# EAGLE design Venus638FLPX-L (EAGLE 6.3)
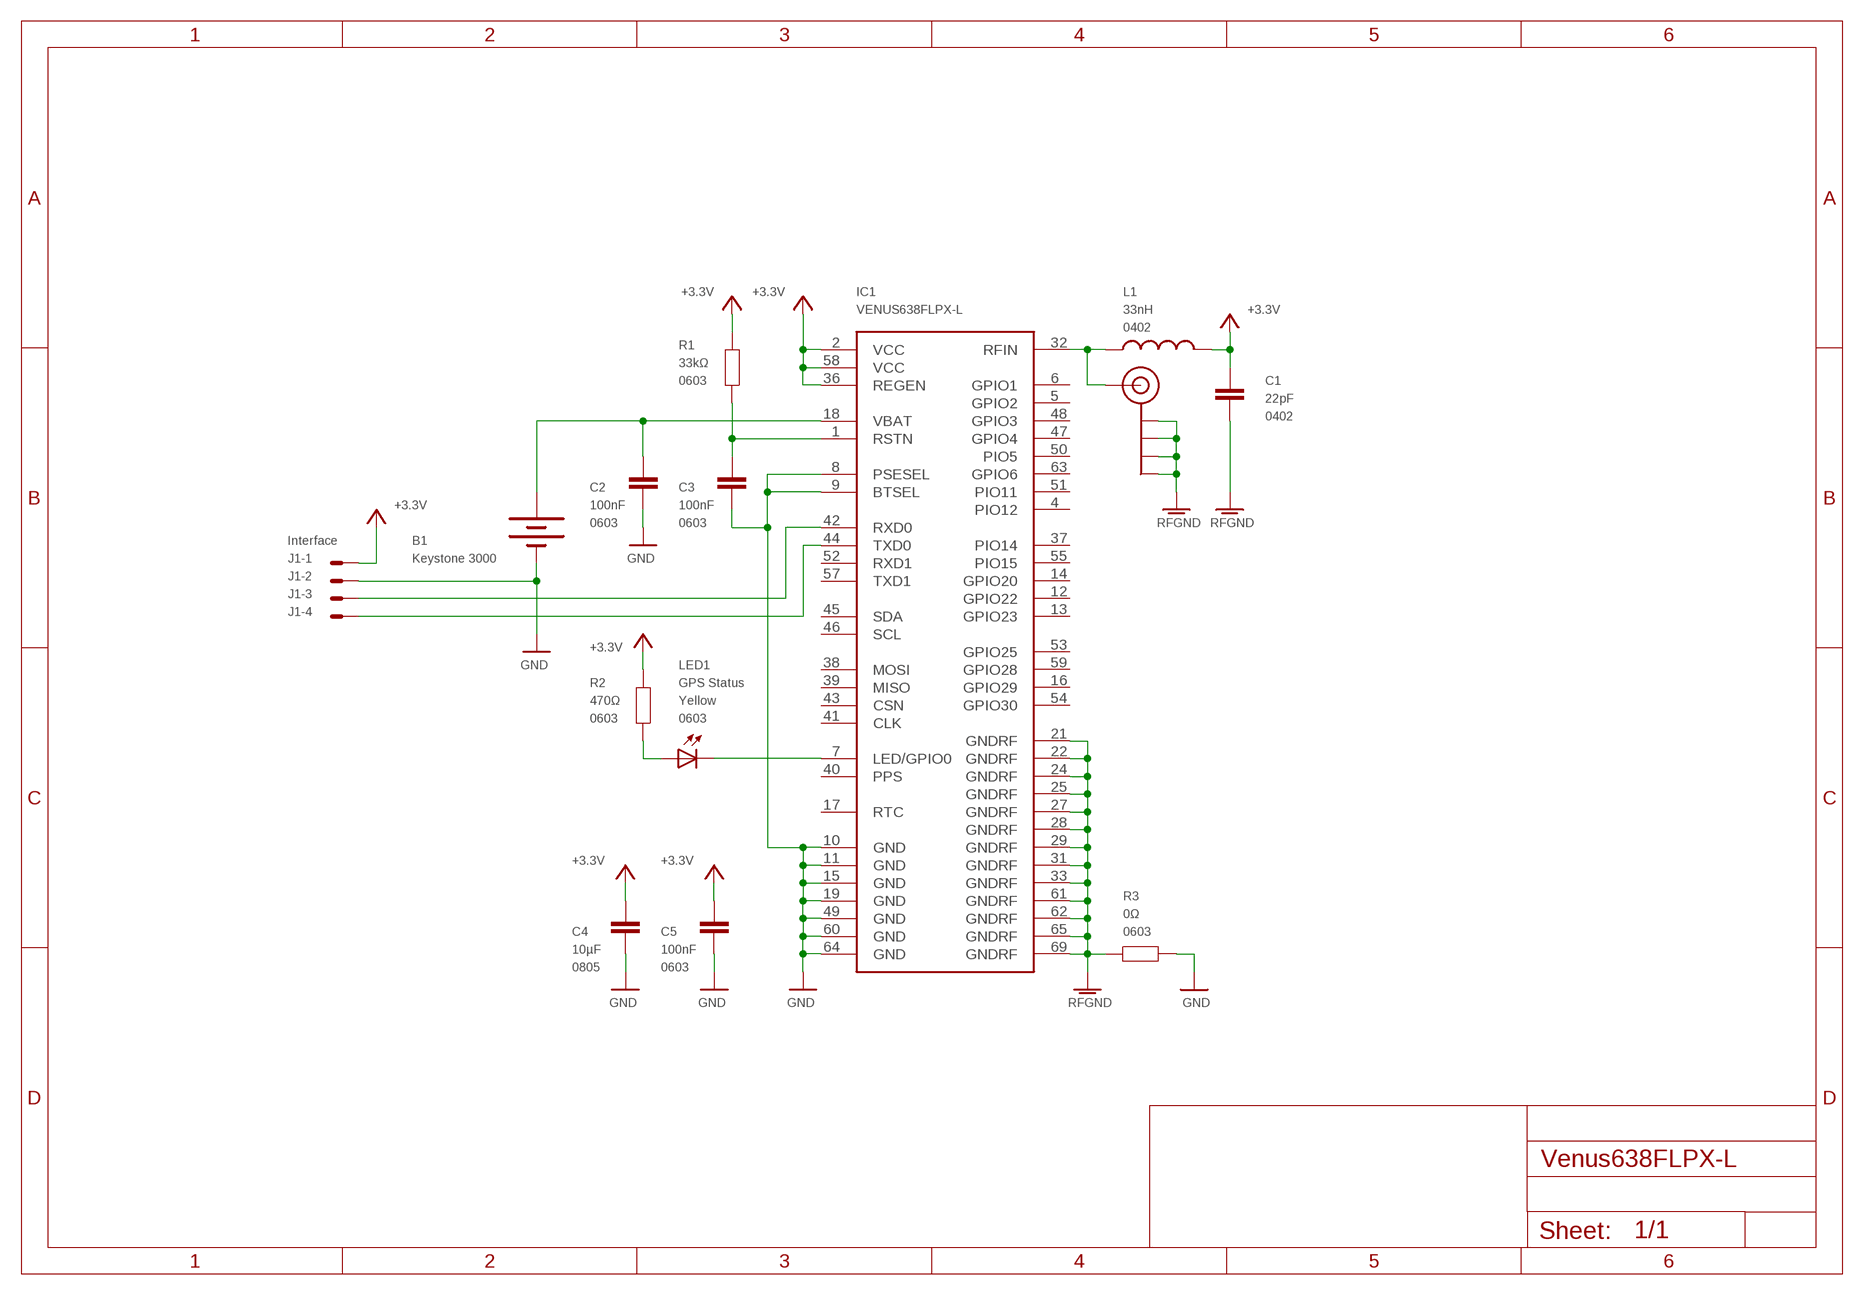
[diagram p0: schematic, sheet 1]

## Parts
B1  Keystone 3000  BATTERY12MM  [BATTCON_12MM]
C1  22pF  CAP0402  [C0402]
C2  100nF  CAP0603  [0603]
C3  100nF  CAP0603  [0603]
C4  10µF  CAP0805  [0805]
C5  100nF  CAP0603  [0603]
IC1  VENUS638FLPX-L  [VENUS638FLPX]
J1  Interface  22-05-7048-04  [7395-04]
JP1  Antenna  SMA_EDGE  [SMA-EDGE]
L1  33nH  INDUCTOR0402  [C0402]
LED1  GPS Status  LED0603  [LED-0603]
R1  33kΩ  RESISTOR0603  [0603]
R2  470Ω  RESISTOR0603  [0603]
R3  0Ω  RESISTOR0603  [0603]

## Nets
+3.3V: C1.2 C4.2 C5.2 IC1.2(VCC) IC1.36(REGEN) IC1.58(VCC) J1.1 L1.1 R1.1 R2.1
ANT2: IC1.32(RFIN) JP1.SIG(SIGNAL) L1.2
GND: B1.GND(-) C2.1 C3.1 C4.1 C5.1 IC1.8(PSESEL) IC1.9(BTSEL) IC1.10(GND) IC1.11(GND) IC1.15(GND) IC1.19(GND) IC1.49(GND) IC1.60(GND) IC1.64(GND) J1.2 R3.1
N$1: C3.2 IC1.1(RSTN) R1.2
N$4: B1.PWR@1(+) C2.2 IC1.18(VBAT)
N$28: IC1.7(LED/GPIO0) LED1.C
N$31: LED1.A R2.2
RFGND: C1.1 IC1.21(GNDRF) IC1.22(GNDRF) IC1.24(GNDRF) IC1.25(GNDRF) IC1.27(GNDRF) IC1.28(GNDRF) IC1.29(GNDRF) IC1.31(GNDRF) IC1.33(GNDRF) IC1.61(GNDRF) IC1.62(GNDRF) IC1.65(GNDRF) IC1.69(GNDRF) JP1.GND@0(GND) JP1.GND@1(GND) JP1.GND@2(GND) JP1.GND@3(GND) R3.2
RXD: IC1.42(RXD0) J1.3
TXD: IC1.44(TXD0) J1.4
Unconnected: IC1.4(PIO12) IC1.5(GPIO2) IC1.6(GPIO1) IC1.12(GPIO22) IC1.13(GPIO23) IC1.14(GPIO20) IC1.16(GPIO29) IC1.17(RTC) IC1.37(PIO14) IC1.38(MOSI) IC1.39(MISO) IC1.40(PPS) IC1.41(CLK) IC1.43(CSN) IC1.45(SDA) IC1.46(SCL) IC1.47(GPIO4) IC1.48(GPIO3) IC1.50(PIO5) IC1.51(PIO11) IC1.52(RXD1) IC1.53(GPIO25) IC1.54(GPIO30) IC1.55(PIO15) IC1.57(TXD1) IC1.59(GPIO28) IC1.63(GPIO6)

## Library data of the parts
B1 = SparkFun:BATTERY: Battery Holders Various common sizes : AA, AAA, 20mm coin cell and 12mm coin cell.
C1 = freetronics-master-v1:CAP: Capacitor Standard 0603 ceramic capacitor, and 0.1" leaded capacitor.; PACKAGE: 0402
C2 C3 C5 = freetronics-master-v1:CAP: Capacitor Standard 0603 ceramic capacitor, and 0.1" leaded capacitor.; PACKAGE: 0603
C4 = freetronics-master-v1:CAP: Capacitor Standard 0603 ceramic capacitor, and 0.1" leaded capacitor.; PACKAGE: 0805
IC1 = mike-temp:VENUS638FLPX-L: Venus638FLPX-L GPS Receiver Venus638FLPx is a high performance, low cost, single chip GPS receiver targeting mobile consumer and cellular handset applications. It offers very low power consumption, high sensitivity, and best in class signal acquisition and time-to-first-fix performance. Venus638FLPx contains all the necessary components of a complete GPS receiver, includes 1.2dB cascaded system NF RF front-end, GPS baseband signal processor, 0.5ppm TCXO, 32.768kHz RTC crystal, RTC LDO regulator, and passive components. It requires very low external component count and takes up only 100mm2 PCB footprint. Dedicated massive-correlator signal parameter search engine within the baseband enables rapid search of all the available satellites and acquisition of very weak signal. An advanced track engine allows weak signal tracking and positioning in harsh environments such as urban canyons and under deep foliage. The self-contained architecture keeps GPS processing off the host and allows integration into applications with very little resource. FEATURES 20Hz update rate -148dBm cold start sensitivity -165dBm tracking sensitivity 29 second cold start TTFF 3.5 second TTFF with AGPS 1 second hot start 2.5m accuracy Multipath detection and suppression Jamming detection and mitigation SBAS (WAAS / EGNOS) support 7-day extended ephemeris AGPS 67mW full power navigation Works directly with active or passive antenna Internal flash for optional 75K point data logging Supports external SPI flash memory data logging Complete receiver in 10mm x 10mm x 1.3mm size Contains LNA, SAW Filter, TCXO, RTC Xtal, LDO Pb-free RoHS compliant
J1 = con-molex:22-?-04: CONNECTOR wire to board 2.54 mm (.1 inch) pitch header; OC_FARNELL: unknown; OC_NEWARK: unknown
JP1 = SparkFun:SMA_EDGE: SMA Antenna Connector End launch SMA connector. The paste layer has been removed so that the connector can be hand soldered onto the board after reflow.
L1 = SparkFun:INDUCTOR: Inductors Basic Inductor/Choke - 0603 and 1206. Footprints are not proven and vary greatly between part numbers.; PACKAGE: 0402
LED1 = freetronics-master-v1:LED: LEDs Standard schematic elements and footprints for 5mm, 3mm, 1206, and 0603 sized LEDs. 5mm - Spark Fun Electronics SKU : COM-00529 (and others); COLOUR: Yellow; PACKAGE: 0603
R1-R3 = freetronics-master-v1:RESISTOR: Resistor Basic schematic elements and footprints for 0603, 1206, and PTH 1/10th watt (small) resistors.; PACKAGE: 0603

## Board
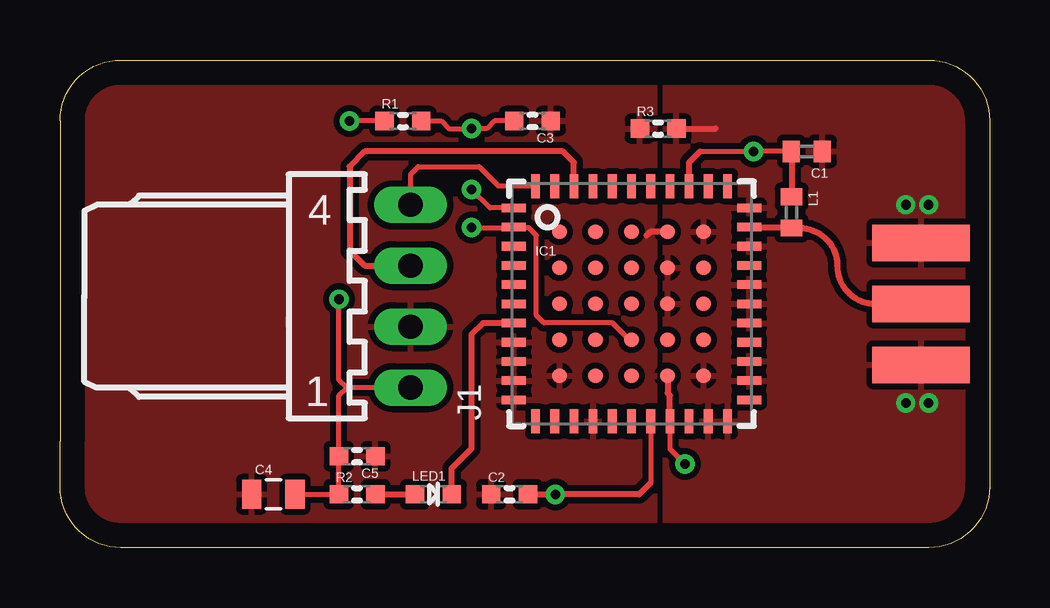
[diagram p1: board, top side]
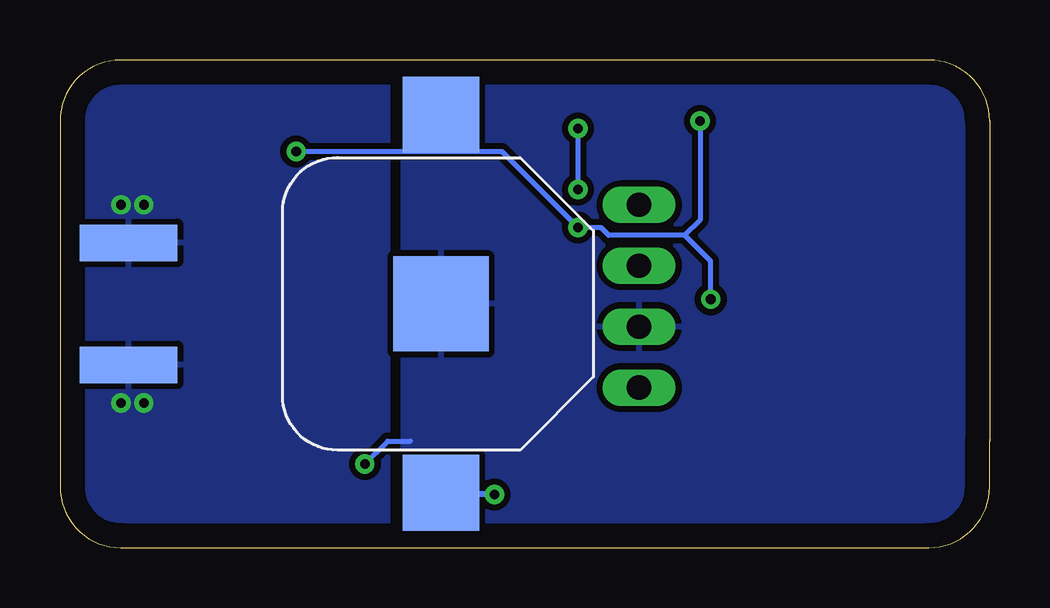
[diagram p2: board, bottom side, seen from below]

Size 38.73 x 20.32 mm. Coordinates in mm from the lower left corner, seen from the top.
Outline: 0,17.78 0,4.45 0,2.54 arc90 2.54,0 36.2,0 arc90 38.74,2.54 38.74,17.78 arc90 36.2,20.32 2.54,20.32 arc90 0,17.78
Copper layers (1*16): Top 0.035mm / dielectric 1.5mm / Bottom 0.035mm
Design rules "default": minimum track width 10mil, minimum drill 24mil, track to track 8mil, track to pad 8mil, pad to pad 8mil, via to via 8mil, smd to smd 8mil, copper to edge 40mil, drill to drill 8mil, minimum pad ring 10mil, minimum via ring 8mil, stop-mask expansion 4mil, vias tented up to drill 0mil, thermal gap 10mil

### Footprints (pad centres in the part's own frame; a part is rotated, then mirrored left to right if it is on the bottom)
BATTCON_12MM = smd 3.962 x 3.962: GND 0,0 | smd 3.175 x 3.175: PWR@1 -7.874,0; PWR@2 7.874,0
C0402 = smd 0.7 x 0.9: 1 -0.65,0; 2 0.65,0
0603 = smd 0.762 x 0.762: 1 -0.762,0; 2 0.762,0
0805 = smd 0.8 x 1.2: 1 -0.9,0; 2 0.9,0
VENUS638FLPX = smd 1 x 0.36: 1 -4.9,4; 2 -4.9,3.2; 3 -4.9,2.4; 4 -4.9,1.6; 5 -4.9,0.8; 6 -4.9,0; 7 -4.9,-0.8; 8 -4.9,-1.6; 9 -4.9,-2.4; 10 -4.9,-3.2; 11 -4.9,-4; 23 4.9,-4; 24 4.9,-3.2; 25 4.9,-2.4; 26 4.9,-1.6; 27 4.9,-0.8; 28 4.9,0; 29 4.9,0.8; 30 4.9,1.6; 31 4.9,2.4; 32 4.9,3.2; 33 4.9,4 | smd 0.36 x 1: 12 -4,-4.9; 13 -3.2,-4.9; 14 -2.4,-4.9; 15 -1.6,-4.9; 16 -0.8,-4.9; 17 0,-4.9; 18 0.8,-4.9; 19 1.6,-4.9; 20 2.4,-4.9; 21 3.2,-4.9; 22 4,-4.9; 34 4,4.9; 35 3.2,4.9; 36 2.4,4.9; 37 1.6,4.9; 38 0.8,4.9; 39 0,4.9; 40 -0.8,4.9; 41 -1.6,4.9; 42 -2.4,4.9; 43 -3.2,4.9; 44 -4,4.9 | smd 0.6 x 0.6: 45 -3,3; 46 -3,1.5; 47 -3,0; 48 -3,-1.5; 49 -3,-3; 50 -1.5,3; 51 -1.5,1.5; 52 -1.5,0; 53 -1.5,-1.5; 54 -1.5,-3; 55 0,3; 56 0,1.5; 57 0,0; 58 0,-1.5; 59 0,-3; 60 1.5,3; 61 1.5,1.5; 62 1.5,0; 63 1.5,-1.5; 64 1.5,-3; 65 3,3; 66 3,1.5; 67 3,0; 68 3,-1.5; 69 3,-3
7395-04 = drill 1.016 long: 1 3.81,0; 2 1.27,0; 3 -1.27,0; 4 -3.81,0
SMA-EDGE = smd 1.524 x 4.064: GND@0 0,0; GND@1 5.08,0; SIG 2.54,0 | smd 1.524 x 4.064 bottom: GND@2 0,0; GND@3 5.08,0
LED-0603 = smd 0.762 x 0.762: A -0.762,0; C 0.762,0

### Placement (x,y rotation side)
B1  22.86,10.16 90 bottom
C1  31.12,16.51 180 top
C2  18.73,2.22 0 top
C3  19.69,17.78 180 top
C4  8.89,2.22 0 top
C5  12.38,3.81 180 top
IC1  23.81,10.16 0 top
J1  14.6,10.48 270 top
JP1  35.88,7.62 90 top
L1  30.48,13.97 270 top
LED1  15.56,2.22 0 top
R1  14.29,17.78 0 top
R2  12.38,2.22 0 top
R3  24.92,17.46 0 top

### Tracks (layer width: path | path; a pad name or v marks a point on that pad's centre or on a via)
+3.3V  (via drill 0.4)
  Top 0.203: IC1.58 23.73,8.66 23.02,9.37 20.16,9.37 19.84,9.68 19.84,13.02 19.53,13.34 18.94,13.34 IC1.2 18.89,13.34 v17.14,13.34 | C1.2 v28.89,16.51 26.67,16.51 | R1.1 v12.07,17.78 | C4.2 R2.1 C5.2 11.62,6.35 11.94,6.67 | v11.62,10.35 11.62,6.98 11.94,6.67 | J1.1 11.94,6.67
  Top 0.254: 26.67,16.51 26.21,16.05 IC1.36 26.19,15.04 | L1.1 30.48,16.51 C1.2
  Bottom 0.203: v28.89,16.51 20.32,16.51 v17.14,13.34 16.19,13.34 15.87,13.02 12.7,13.02 | v12.07,17.78 12.07,13.65 12.7,13.02 | v11.62,10.35 11.62,11.94 12.7,13.02
ANT2
  Top 0.254: IC1.32 30.44,13.36 L1.2 30.81,13.32 arc-90 32.39,11.75 arc90 33.97,10.16 JP1.SIG
GND  (via drill 0.4)
  Top 0.203: IC1.19 25.41,4.12 v26.03,3.49
  Top 0.254: IC1.64 25.31,6.44 25.41,6.34 IC1.19 | IC1.60 24.59,13.16 24.45,13.02
  Bottom 0.203: v26.03,3.49 25.08,4.45 24.13,4.45
  pour Top (isolate 0.254): -0.64,20.95 24.77,20.95 24.77,-0.63 -0.64,-0.63
  pour Bottom (isolate 0.254): -0.64,20.95 24.45,20.95 24.45,-0.63 -0.64,-0.63
N$1  (via drill 0.4)
  Top 0.203: IC1.1 17.91,14.16 v17.14,14.92 | C3.2 18.1,17.78 17.78,17.46 v17.14,17.46 16.19,17.46 15.87,17.78 R1.2
  Bottom 0.203: v17.14,14.92 v17.14,17.46
N$4  (via drill 0.4)
  Top 0.203: IC1.18 24.61,2.71
  Top 0.254: 24.61,2.71 24.13,2.22 v20.64,2.22 C2.2
  Bottom 0.254: v20.64,2.22 22.16,2.22 B1.PWR@1
N$28
  Top 0.254: IC1.7 17.62,9.36 17.14,8.89 17.14,4.13 16.32,3.3 LED1.C
N$31
  Top 0.254: R2.2 LED1.A
RFGND  (via drill 0.4)
  Top 0.254: R3.2 27.3,17.46
  other vias: 35.24,14.29 36.2,14.29 35.24,6.03 36.2,6.03
  pour Top (isolate 0.254): 25.24,20.95 39.37,20.95 39.37,-0.63 25.24,-0.63
  pour Bottom (isolate 0.254): 25.08,20.95 39.37,20.95 39.37,-0.63 25.08,-0.63
RXD
  Top 0.254: IC1.42 21.41,16.05 20.96,16.51 12.7,16.51 12.07,15.88 12.07,12.38 12.7,11.75 J1.3
TXD
  Top 0.203: J1.4 14.6,15.56 14.92,15.88 17.46,15.88 18.28,15.06 IC1.44